# EAGLE design Arduino_Connection_PCB (EAGLE 9.5.1)
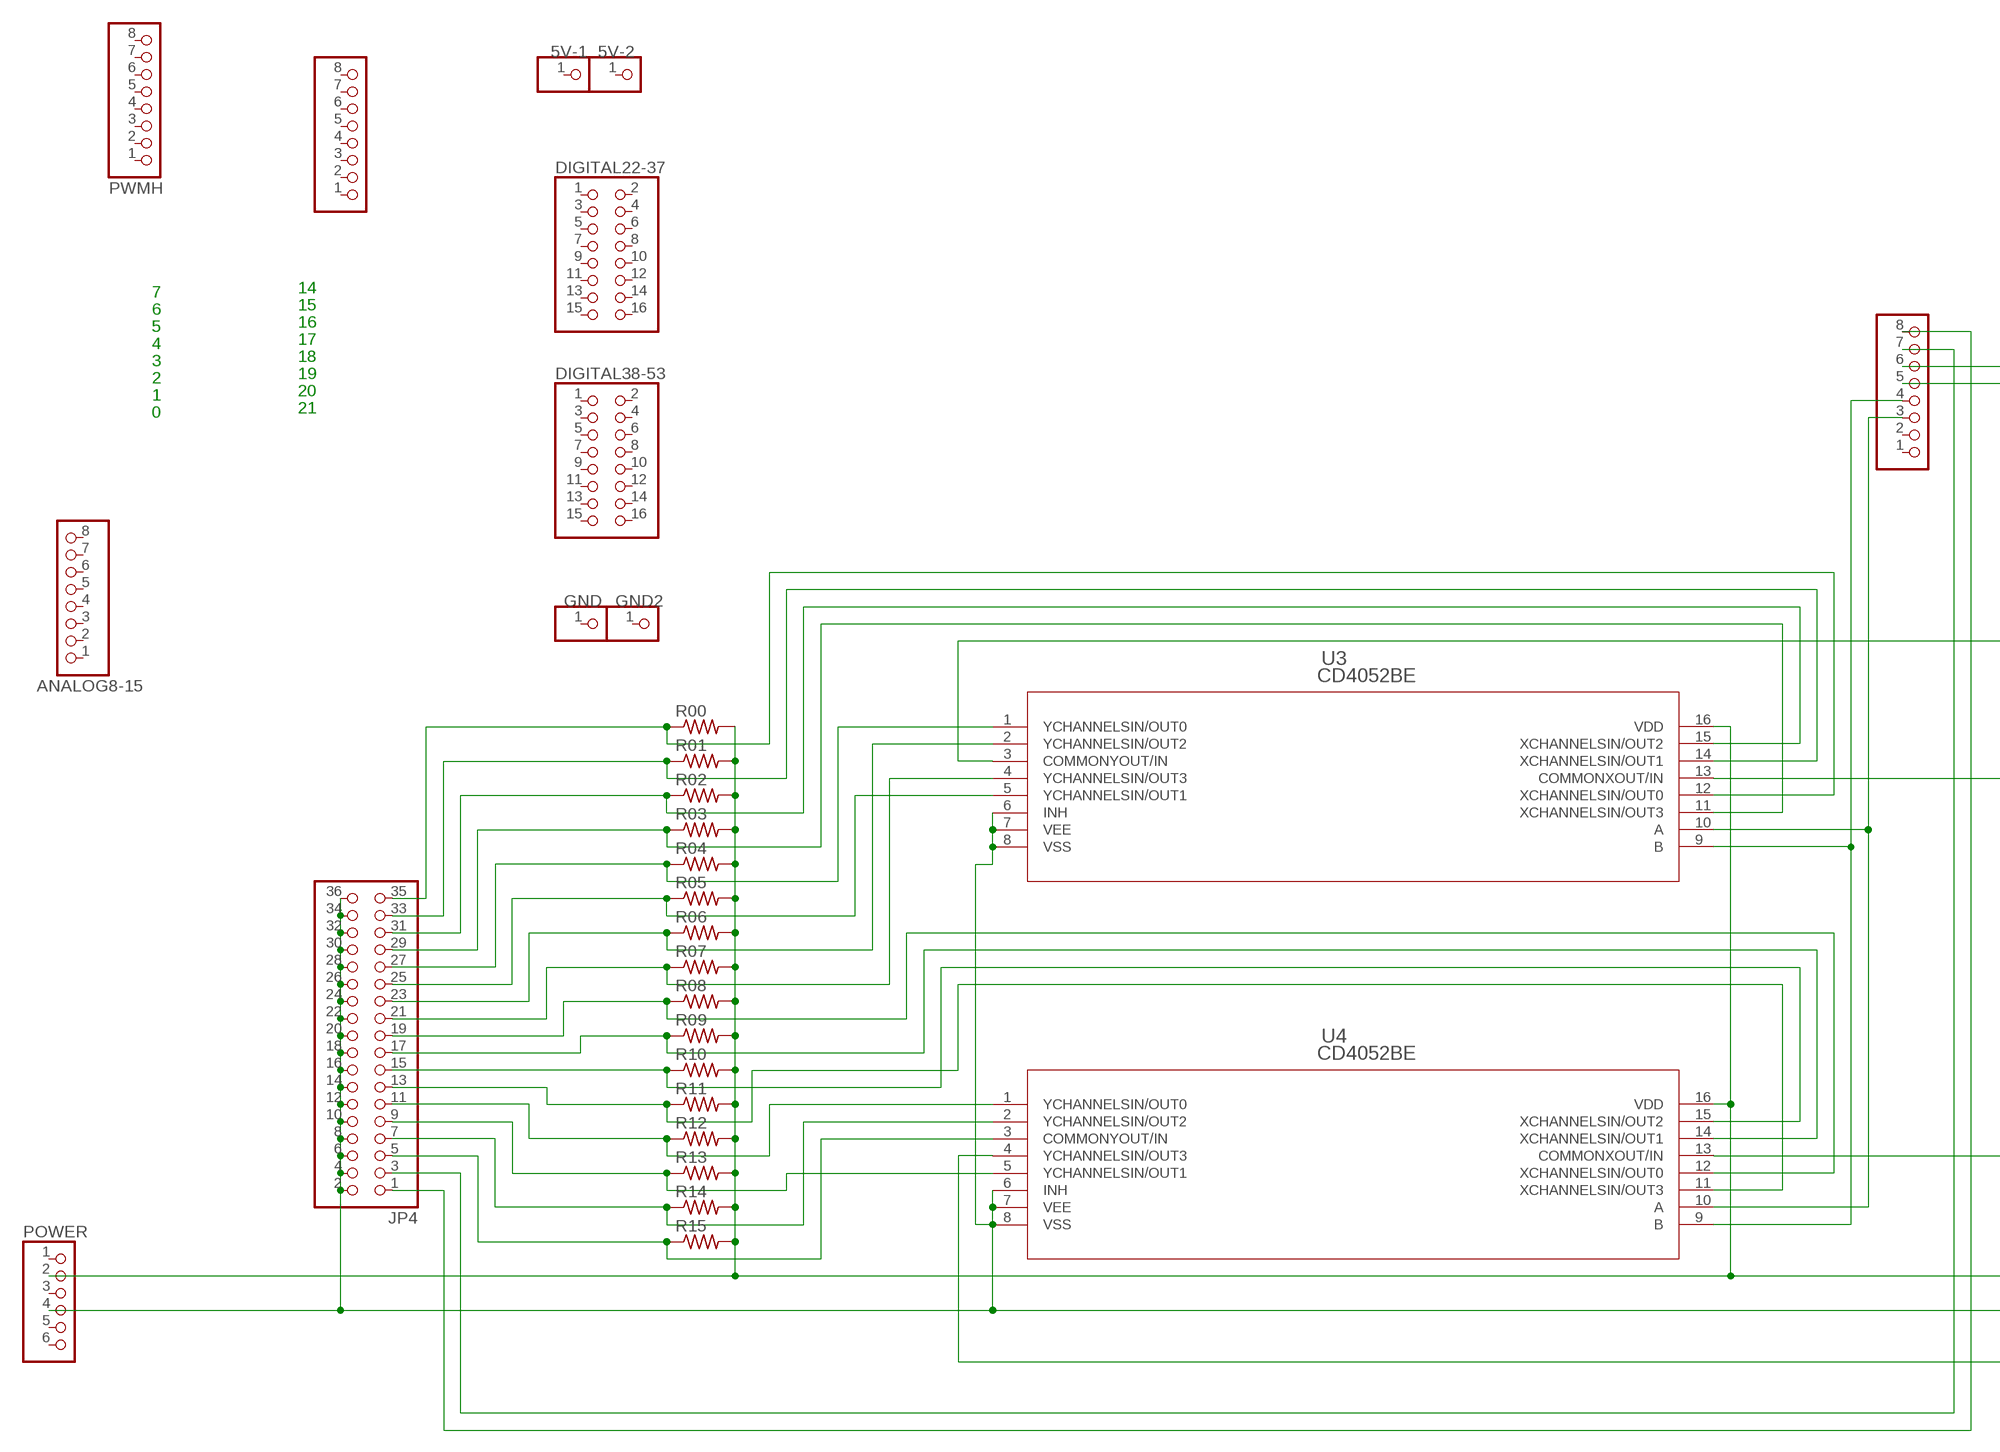
[diagram p0: schematic, sheet 1, part 1 of 2]
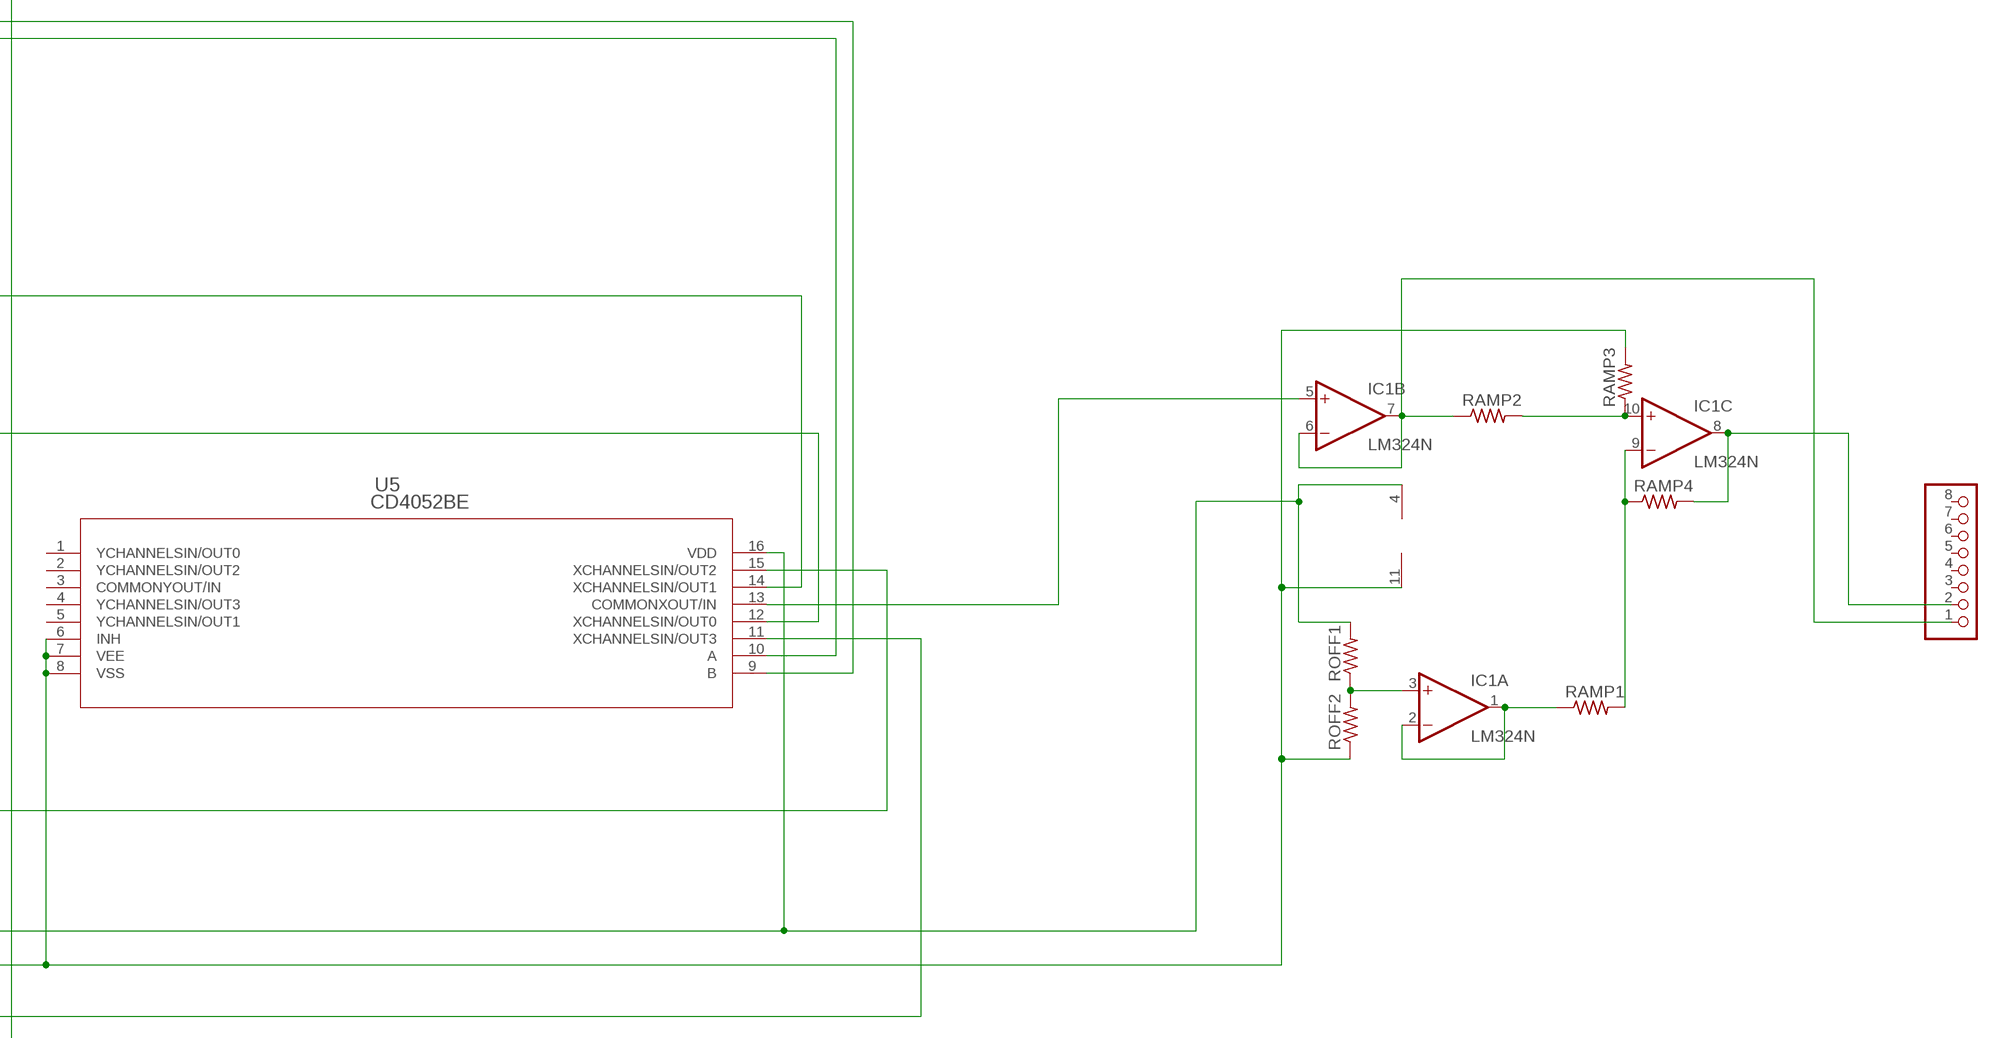
[diagram p1: schematic, sheet 1, part 2 of 2]

## Parts
5V-1  PINHD-1X1  [1X01]
5V-2  PINHD-1X1  [1X01]
ANALOG0-7  PINHD-1X8  [1X08]
ANALOG8-15  PINHD-1X8  [1X08]
COMMUNICATION  PINHD-1X8  [1X08]
DIGITAL22-37  PINHD-2X8  [2X08]
DIGITAL38-53  PINHD-2X8  [2X08]
GND  PINHD-1X1  [1X01]
GND2  PINHD-1X1  [1X01]
IC1  LM324N  [DIL14]
JP4  PINHD-2X18/90  [2X18/90]
POWER  PINHD-1X6  [1X06]
PWMH  PINHD-1X8  [1X08]
PWML  PINHD-1X8  [1X08]
R00  R-US_0204/7  [0204/7]
R01  R-US_0204/7  [0204/7]
R02  R-US_0204/7  [0204/7]
R03  R-US_0204/7  [0204/7]
R04  R-US_0204/7  [0204/7]
R05  R-US_0204/7  [0204/7]
R06  R-US_0204/7  [0204/7]
R07  R-US_0204/7  [0204/7]
R08  R-US_0204/7  [0204/7]
R09  R-US_0204/7  [0204/7]
R10  R-US_0204/7  [0204/7]
R11  R-US_0204/7  [0204/7]
R12  R-US_0204/7  [0204/7]
R13  R-US_0204/7  [0204/7]
R14  R-US_0204/7  [0204/7]
R15  R-US_0204/7  [0204/7]
RAMP1  R-US_0204/7  [0204/7]
RAMP2  R-US_0204/7  [0204/7]
RAMP3  R-US_0204/7  [0204/7]
RAMP4  R-US_0204/7  [0204/7]
ROFF1  R-US_0204/7  [0204/7]
ROFF2  R-US_0204/7  [0204/7]
U3  CD4052BE  [N16]
U4  CD4052BE  [N16]
U5  CD4052BE  [N16]

## Nets
N$1: IC1.5(B:+IN) U5.13(COMMONXOUT/IN)
N$2: ANALOG0-7.1 IC1.6(B:-IN) IC1.7(B:OUT) RAMP2.1
N$3: JP4.3 PWML.7
N$4: JP4.1 PWML.8
N$6: IC1.3(A:+IN) ROFF1.1 ROFF2.2
N$8: IC1.11(P:V-) JP4.2 JP4.4 JP4.6 JP4.8 JP4.10 JP4.12 JP4.14 JP4.16 JP4.18 JP4.20 JP4.22 JP4.24 JP4.26 JP4.28 JP4.30 JP4.32 JP4.34 JP4.36 POWER.4 RAMP3.2 ROFF2.1 U3.6(INH) U3.7(VEE) U3.8(VSS) U4.6(INH) U4.7(VEE) U4.8(VSS) U5.6(INH) U5.7(VEE) U5.8(VSS)
N$9: JP4.13 R11.1 U4.11(XCHANNELSIN/OUT3)
N$10: PWML.3 U3.10(A) U4.10(A)
N$11: IC1.4(P:V+) POWER.2 R00.2 R01.2 R02.2 R03.2 R04.2 R05.2 R06.2 R07.2 R08.2 R09.2 R10.2 R11.2 R12.2 R13.2 R14.2 R15.2 ROFF1.2 U3.16(VDD) U4.16(VDD) U5.16(VDD)
N$12: JP4.25 R05.1 U3.5(YCHANNELSIN/OUT1)
N$13: JP4.35 R00.1 U3.12(XCHANNELSIN/OUT0)
N$14: PWML.4 U3.9(B) U4.9(B)
N$15: JP4.19 R08.1 U4.12(XCHANNELSIN/OUT0)
N$16: JP4.21 R07.1 U3.4(YCHANNELSIN/OUT3)
N$17: JP4.17 R09.1 U4.14(XCHANNELSIN/OUT1)
N$18: JP4.5 R15.1 U4.3(COMMONYOUT/IN)
N$19: JP4.7 R14.1 U4.2(YCHANNELSIN/OUT2)
N$20: JP4.9 R13.1 U4.5(YCHANNELSIN/OUT1)
N$21: JP4.11 R12.1 U4.1(YCHANNELSIN/OUT0)
N$22: PWML.5 U5.10(A)
N$23: JP4.15 R10.1 U4.15(XCHANNELSIN/OUT2)
N$24: PWML.6 U5.9(B)
N$25: IC1.1(A:OUT) IC1.2(A:-IN) RAMP1.1
N$26: IC1.9(C:-IN) RAMP1.2 RAMP4.1
N$27: IC1.10(C:+IN) RAMP2.2 RAMP3.1
N$29: ANALOG0-7.2 IC1.8(C:OUT) RAMP4.2
N$30: U3.13(COMMONXOUT/IN) U5.12(XCHANNELSIN/OUT0)
N$31: U3.3(COMMONYOUT/IN) U5.14(XCHANNELSIN/OUT1)
N$32: U4.13(COMMONXOUT/IN) U5.15(XCHANNELSIN/OUT2)
N$33: U4.4(YCHANNELSIN/OUT3) U5.11(XCHANNELSIN/OUT3)
N$34: JP4.31 R02.1 U3.15(XCHANNELSIN/OUT2)
N$35: JP4.27 R04.1 U3.1(YCHANNELSIN/OUT0)
N$36: JP4.23 R06.1 U3.2(YCHANNELSIN/OUT2)
N$37: JP4.29 R03.1 U3.11(XCHANNELSIN/OUT3)
N$38: JP4.33 R01.1 U3.14(XCHANNELSIN/OUT1)
Unconnected: 5V-1.1 5V-2.1 ANALOG0-7.3 ANALOG0-7.4 ANALOG0-7.5 ANALOG0-7.6 ANALOG0-7.7 ANALOG0-7.8 ANALOG8-15.1 ANALOG8-15.2 ANALOG8-15.3 ANALOG8-15.4 ANALOG8-15.5 ANALOG8-15.6 ANALOG8-15.7 ANALOG8-15.8 COMMUNICATION.1 COMMUNICATION.2 COMMUNICATION.3 COMMUNICATION.4 COMMUNICATION.5 COMMUNICATION.6 COMMUNICATION.7 COMMUNICATION.8 DIGITAL22-37.1 DIGITAL22-37.2 DIGITAL22-37.3 DIGITAL22-37.4 DIGITAL22-37.5 DIGITAL22-37.6 DIGITAL22-37.7 DIGITAL22-37.8 DIGITAL22-37.9 DIGITAL22-37.10 DIGITAL22-37.11 DIGITAL22-37.12 DIGITAL22-37.13 DIGITAL22-37.14 DIGITAL22-37.15 DIGITAL22-37.16 DIGITAL38-53.1 DIGITAL38-53.2 DIGITAL38-53.3 DIGITAL38-53.4 DIGITAL38-53.5 DIGITAL38-53.6 DIGITAL38-53.7 DIGITAL38-53.8 DIGITAL38-53.9 DIGITAL38-53.10 DIGITAL38-53.11 DIGITAL38-53.12 DIGITAL38-53.13 DIGITAL38-53.14 DIGITAL38-53.15 DIGITAL38-53.16 GND2.1 GND.1 IC1.12(D:+IN) IC1.13(D:-IN) IC1.14(D:OUT) POWER.1 POWER.3 POWER.5 POWER.6 PWMH.1 PWMH.2 PWMH.3 PWMH.4 PWMH.5 PWMH.6 PWMH.7 PWMH.8 PWML.1 PWML.2 U5.1(YCHANNELSIN/OUT0) U5.2(YCHANNELSIN/OUT2) U5.3(COMMONYOUT/IN) U5.4(YCHANNELSIN/OUT3) U5.5(YCHANNELSIN/OUT1)

## Notes on the sheet
- 7 | 14
- 6 | 15
- 5 | 16
- 4 | 17
- 3 | 18
- 2 | 19
- 1 | 20
- 0 | 21

## Library data of the parts
5V-1 5V-2 GND GND2 = pinhead:PINHD-1X1: PIN HEADER
ANALOG0-7 ANALOG8-15 COMMUNICATION PWMH PWML = pinhead:PINHD-1X8: PIN HEADER
DIGITAL22-37 DIGITAL38-53 = pinhead:PINHD-2X8: PIN HEADER
IC1 = linear:LM324: OP AMP
JP4 = pinhead:PINHD-2X18: PIN HEADER
POWER = pinhead:PINHD-1X6: PIN HEADER
R00 R01-R09 R10-R15 RAMP1-RAMP4 ROFF1 ROFF2 = rcl:R-US_: RESISTOR, American symbol; SPICEPREFIX: R
U3-U5 = cd4052:CD4052BE; BUILT_BY: EMA_UL_Team; MANUFACTURER_PART_NUMBER: CD4052BE; VENDOR: Texas Instruments

## Net classes
0 default: width 0.15 mm, drill 0.3 mm, clearance 0.15 mm

## Board
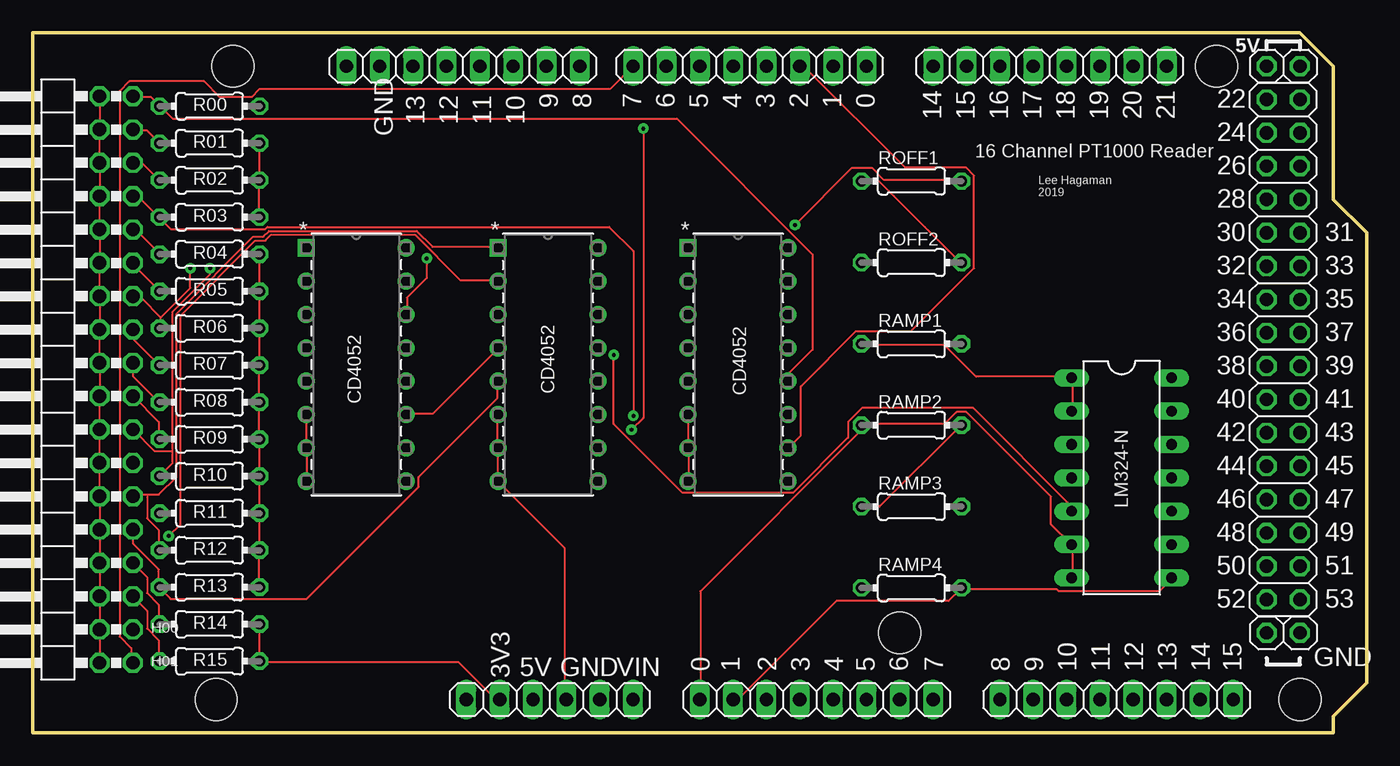
[diagram p2: board, top side]
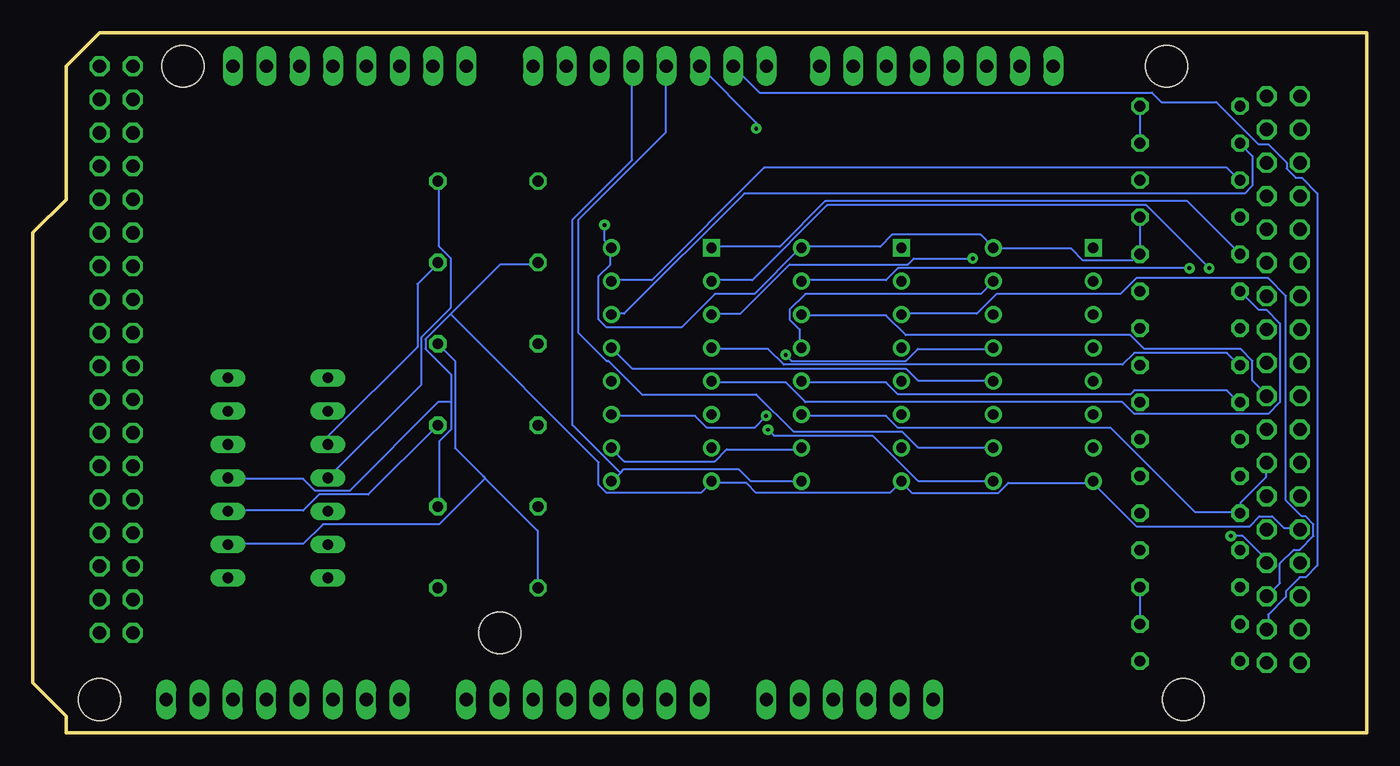
[diagram p3: board, bottom side, seen from below]

Size 101.6 x 53.34 mm. Coordinates in mm from the lower left corner, seen from the top.
Outline: 0,53.34 96.52,53.34 99.06,50.8 99.06,40.64 101.6,38.1 101.6,3.81 99.06,1.27 99.06,0 0,0 0,53.34
Copper layers (1*16): Top 0.035mm / dielectric 1.5mm / Bottom 0.035mm
Design rules "default *": minimum track width 0.15mm, minimum drill 0.3mm, track to track 0.15mm, track to pad 0.15mm, pad to pad 0.15mm, via to via 0.15mm, smd to smd 0.15mm, copper to edge 0.6mm, drill to drill 0.3mm, minimum pad ring 10mil, minimum via ring 10mil, stop-mask expansion 2mil, vias tented up to drill 1mil, thermal gap 10mil
Holes 3.2 mm at 96.52,2.54 15.24,50.8 90.17,50.8 13.97,2.54 66.04,7.62
tRestrict: area 22,18.2 to 27.6,37.5; area 36.4,18.9 to 42.3,37.8; area 50.8,18.8 to 56.8,38.1; area 80.6,11.2 to 85,28.2
vRestrict: area 22,18 to 27.7,37.6; area 35.9,18.4 to 42.4,37.7; area 50.8,18.8 to 56.9,37.7; area 80.6,11.2 to 85.1,28.1

### Footprints (pad centres in the part's own frame; a part is rotated, then mirrored left to right if it is on the bottom)
1X01 = drill 1.016 octagon: 1 0,0
1X08 = drill 1.016 long: 1 -8.89,0; 2 -6.35,0; 3 -3.81,0; 4 -1.27,0; 5 1.27,0; 6 3.81,0; 7 6.35,0; 8 8.89,0
2X08 = drill 1.016 octagon: 1 -8.89,-1.27; 2 -8.89,1.27; 3 -6.35,-1.27; 4 -6.35,1.27; 5 -3.81,-1.27; 6 -3.81,1.27; 7 -1.27,-1.27; 8 -1.27,1.27; 9 1.27,-1.27; 10 1.27,1.27; 11 3.81,-1.27; 12 3.81,1.27; 13 6.35,-1.27; 14 6.35,1.27; 15 8.89,-1.27; 16 8.89,1.27
DIL14 = drill 0.813 long: 1 -7.62,-3.81; 2 -5.08,-3.81; 3 -2.54,-3.81; 4 0,-3.81; 5 2.54,-3.81; 6 5.08,-3.81; 7 7.62,-3.81; 8 7.62,3.81; 9 5.08,3.81; 10 2.54,3.81; 11 0,3.81; 12 -2.54,3.81; 13 -5.08,3.81; 14 -7.62,3.81
2X18/90 = drill 1.016 octagon: 1 -21.59,-6.35; 2 -21.59,-3.81; 3 -19.05,-6.35; 4 -19.05,-3.81; 5 -16.51,-6.35; 6 -16.51,-3.81; 7 -13.97,-6.35; 8 -13.97,-3.81; 9 -11.43,-6.35; 10 -11.43,-3.81; 11 -8.89,-6.35; 12 -8.89,-3.81; 13 -6.35,-6.35; 14 -6.35,-3.81; 15 -3.81,-6.35; 16 -3.81,-3.81; 17 -1.27,-6.35; 18 -1.27,-3.81; 19 1.27,-6.35; 20 1.27,-3.81; 21 3.81,-6.35; 22 3.81,-3.81; 23 6.35,-6.35; 24 6.35,-3.81; 25 8.89,-6.35; 26 8.89,-3.81; 27 11.43,-6.35; 28 11.43,-3.81; 29 13.97,-6.35; 30 13.97,-3.81; 31 16.51,-6.35; 32 16.51,-3.81; 33 19.05,-6.35; 34 19.05,-3.81; 35 21.59,-6.35; 36 21.59,-3.81
1X06 = drill 1.016 long: 1 -6.35,0; 2 -3.81,0; 3 -1.27,0; 4 1.27,0; 5 3.81,0; 6 6.35,0
0204/7 = drill 0.813 octagon: 1 -3.81,0; 2 3.81,0
N16 = drill 0.787 pad 1.295 square: 1 -7.62,17.78 | drill 0.787 pad 1.295: 2 -7.62,15.24; 3 -7.62,12.7; 4 -7.62,10.16; 5 -7.62,7.62; 6 -7.62,5.08; 7 -7.62,2.54; 8 -7.62,0; 9 0,0; 10 0,2.54; 11 0,5.08; 12 0,7.62; 13 0,10.16; 14 0,12.7; 15 0,15.24; 16 0,17.78

### Placement (x,y rotation side)
5V-1  93.98,50.8 0 top
5V-2  96.52,50.8 0 top
ANALOG0-7  59.69,2.54 0 top
ANALOG8-15  82.55,2.54 0 top
COMMUNICATION  77.47,50.8 180 top
DIGITAL22-37  95.25,39.37 90 top
DIGITAL38-53  95.25,19.05 90 top
GND  93.98,7.62 0 top
GND2  96.52,7.62 0 top
IC1  82.93,19.43 270 top
JP4  1.27,26.92 90 top
POWER  39.37,2.54 0 top
PWMH  32.77,50.8 180 top
PWML  54.61,50.8 180 top
R00  13.46,47.75 0 top
R01  13.46,44.93 0 top
R02  13.46,42.11 0 top
R03  13.46,39.29 0 top
R04  13.46,36.47 0 top
R05  13.46,33.65 0 top
R06  13.46,30.84 0 top
R07  13.46,28.02 0 top
R08  13.46,25.2 0 top
R09  13.46,22.38 0 top
R10  13.46,19.56 0 top
R11  13.46,16.74 0 top
R12  13.46,13.92 0 top
R13  13.46,11.1 0 top
R14  13.46,8.28 0 top
R15  13.46,5.46 0 top
RAMP1  66.93,29.64 0 top
RAMP2  66.93,23.44 0 top
RAMP3  66.93,17.25 0 top
RAMP4  66.93,11.05 0 top
ROFF1  66.93,42.04 0 top
ROFF2  66.93,35.84 0 top
U3  57.53,19.18 0 top
U4  43.05,19.18 0 top
U5  28.45,19.18 0 top

### Tracks (layer width: path | path; a pad name or v marks a point on that pad's centre or on a via)
N$1  (via drill 0.3)
  Top 0.15: v44.25,28.8 44.25,23.55 49.5,18.3 57.9,18.3 62.1,22.5 62.1,23.7 63.15,24.75 71.63,24.75 79.12,17.26 IC1.5
  Bottom 0.15: v44.25,28.8 43.8,28.35 35.1,28.35 34.2,29.25 28.5,29.25 U5.13
N$2
  Top 0.15: IC1.7 79.2,11.85 79.2,14.25 IC1.6 79.05,14.4 77.55,15.9 77.55,18 71.1,24.45 70.35,24.45 69.45,23.55 63.15,23.55 RAMP2.1 63,23.4 63,22.95 50.85,10.8 50.85,2.55 ANALOG0-7.1
N$3
  Bottom 0.15: JP4.3 7.5,7.95 7.5,9 6.15,10.35 6.15,10.8 5.1,11.85 4.65,11.85 3.75,12.75 3.75,41.1 4.95,42.3 5.4,42.3 6.09,42.99 6.09,43.44 7.5,44.85 8.25,44.85 11.47,48.07 15.63,48.07 16.36,48.8 46.25,48.8 48.15,50.7 PWML.7
N$4
  Top 0.15: JP4.1 7.5,5.4 7.5,6.45 6.6,7.35 6.6,48.9 7.35,49.65 13.05,49.65 14.25,48.45 16.65,48.45 17.25,49.05 43.95,49.05 45.6,50.7 PWML.8
N$6
  Top 0.15: ROFF1.1 63.15,42 64.5,42 70.65,35.85 ROFF2.2
  Bottom 0.15: IC1.3 79.05,22.05 79.05,22.65 72.3,29.4 72.3,34.2 70.8,35.7 ROFF2.2
N$8
  Top 0.15: JP4.2 5.1,5.4 5.1,7.8 JP4.4 5.1,7.95 5.1,10.35 JP4.6 5.1,10.5 5.1,12.9 JP4.8 5.1,13.05 5.1,15.45 JP4.10 5.1,15.6 5.1,18 JP4.12 5.1,18.15 5.1,20.55 JP4.14 5.1,20.7 5.1,23.1 JP4.16 5.1,23.25 5.1,25.65 JP4.18 5.1,25.8 5.1,28.05 JP4.20 5.1,28.2 5.1,30.6 JP4.22 5.1,30.75 5.1,33.15 JP4.24 5.1,33.3 5.1,35.7 JP4.26 5.1,35.85 5.1,38.25 JP4.28 5.1,38.4 5.1,40.8 JP4.30 5.1,40.95 5.1,43.35 JP4.32 5.1,43.5 5.1,45.9 JP4.34 5.1,46.05 5.1,48.45 JP4.36 | U3.8 49.95,19.2 49.95,21.6 U3.7 49.95,21.75 49.95,24.15 U3.6 | U5.8 20.85,19.2 20.85,21.6 U5.7 20.85,21.75 20.85,24.15 U5.6 | U4.6 35.4,24.15 35.4,21.75 U4.7 35.4,21.6 35.4,19.2 U4.8 35.55,19.05 40.5,14.1 40.5,2.55 POWER.4
  Bottom 0.15: 69.75,25.21 69.75,27.3 71.7,29.25 71.7,30 69.8,31.9 | 69.75,25.21 69.75,23.1 70.65,22.2 70.65,17.25 RAMP3.2 | 69.8,31.9 66,35.7 63.15,35.7 ROFF2.1 | 69.75,25.21 70.72,25.21 77.48,18.45 80.1,18.45 81,19.35 86.7,19.35 IC1.11 | 20.85,19.05 27.3,19.05 28.05,18.3 34.65,18.3 35.4,19.05 U4.8 35.55,19.05 36.3,18.3 46.5,18.3 47.25,19.05 49.8,19.05 U3.8 49.95,19.05 50.7,18.3 57.9,18.3 58.5,18.9 58.5,20.61 69.8,31.9 | 20.85,19.05 17.55,15.75 8.92,15.75 8.17,16.5 7.2,16.5 6.3,15.6 5.1,15.6 JP4.10 | 20.85,19.05 U5.8
N$9
  Bottom 0.15: U4.11 43.05,24.15 36.6,24.15 35.7,23.25 19.5,23.25 13.05,16.8 9.75,16.8 R11.1 9.6,16.8 9.6,17.55 7.65,19.5 7.65,20.55 JP4.13
N$10
  Top 0.15: PWML.3 58.5,50.7 58.8,50.7 66.45,43.05 71.1,43.05 71.7,42.45 71.7,35.4 66.9,30.6 62.7,30.6 58.5,26.4 58.5,22.65 57.6,21.75 U3.10
  Bottom 0.15: U4.10 43.2,21.6 48.75,21.6 49.65,20.7 56.55,20.7 57.45,21.6 U3.10
N$11  (via drill 0.3)
  Top 0.15: R14.2 17.25,8.25 17.25,5.55 R15.2 17.4,5.4 32.4,5.4 35.25,2.55 POWER.2 | R13.2 17.25,11.1 17.25,13.8 R12.2 17.25,13.95 17.25,16.65 R11.2 17.25,16.8 17.25,19.5 R10.2 17.25,19.65 17.25,22.35 R09.2 17.25,22.5 17.25,25.05 R08.2 17.25,25.2 17.25,27.9 R07.2 17.25,28.05 17.25,30.75 R06.2 17.25,30.9 17.25,33.6 R05.2 17.25,33.75 17.25,36.45 R04.2 | R01.2 17.25,44.85 17.25,42.15 R02.2 17.25,42 17.25,39.3 R03.2 | v58.05,38.7 62.4,43.05 63.9,43.05 64.8,42.15 70.65,42.15 ROFF1.2
  Bottom 0.15: R13.2 17.25,10.95 17.25,8.4 R14.2 | ROFF1.2 70.65,42 70.65,37.05 69.75,36.15 69.75,32.4 72,30.15 72,26.55 79.05,19.5 IC1.4 | R00.2 17.25,47.7 17.25,45 R01.2 | R03.2 17.25,39.15 17.25,36.6 R04.2 17.4,36.45 17.85,36 21.6,36 22.5,36.9 28.35,36.9 U5.16 28.5,37.05 29.4,37.95 36.15,37.95 37.05,37.05 43.05,37.05 U4.16 43.2,36.9 46.65,33.45 49.65,33.45 52.2,30.9 57.9,30.9 58.5,31.5 58.5,34.8 57.6,35.7 57.6,36.9 U3.16 57.6,37.05 58.05,37.5 v58.05,38.7
N$12
  Top 0.15: JP4.25 7.65,35.7 9.6,33.75 R05.1
  Bottom 0.15: U3.5 49.8,26.7 44.25,26.7 42.75,25.2 18.6,25.2 17.7,24.3 7.5,24.3 6.6,25.2 6.6,31.2 7.65,32.25 8.25,32.25 9.6,33.6 R05.1
N$13
  Top 0.15: U3.12 57.6,26.85 57.6,27.41 59.39,29.2 59.39,36.46 49.05,46.8 10.65,46.8 9.75,47.7 R00.1 9.6,47.85 9,48.45 7.65,48.45 JP4.35
N$14
  Bottom 0.15: 56.85,19.8 57.45,19.2 U3.9 | 56.85,19.8 56.55,20.1 47.85,20.1 46.95,19.2 43.2,19.2 U4.9 | 56.85,19.8 60.5,23.45 60.5,39.1 55.95,43.65 55.95,50.7 PWML.4
N$15
  Top 0.15: JP4.19 7.65,28.05 7.65,27.15 9.6,25.2 R08.1
  Bottom 0.15: U4.12 43.05,26.7 36.6,26.7 35.7,25.8 18,25.8 17.7,26.1 10.65,26.1 9.75,25.2 R08.1
N$16
  Top 0.15: JP4.21 7.65,30.6 7.65,30 9.6,28.05 R07.1
  Bottom 0.15: U3.4 49.8,29.25 45.6,29.25 44.4,28.05 18.6,28.05 17.7,28.95 10.65,28.95 9.75,28.05 R07.1
N$17
  Top 0.15: R09.1 9.6,22.5 9.6,23.7 7.65,25.65 JP4.17
  Bottom 0.15: U4.14 43.05,31.8 36.6,31.8 35.1,30.3 18,30.3 16.95,29.25 9.6,29.25 8.7,28.35 8.7,26.85 7.65,25.8 JP4.17
N$18
  Top 0.15: R15.1 9.6,5.55 9.6,7.05 8.7,7.95 8.7,9.3 7.65,10.35 JP4.5
  Bottom 0.15: U4.3 35.4,31.95 29.7,31.95 28.2,33.45 18.75,33.45 17.55,34.65 7.5,34.65 6.15,33.3 6.15,17.7 4.95,16.5 4.65,16.5 4.05,15.9 4.05,15 5.1,13.95 5.55,13.95 6.6,12.9 6.6,11.4 7.5,10.5 JP4.5
N$19  (via drill 0.3)
  Top 0.15: v10.35,15 11.25,15.9 11.25,31.8 16.95,37.5 17.7,37.5 18.15,37.95 29.1,37.95 32.55,34.5 35.4,34.5 U4.2 | R14.1 9.6,8.4 9.6,9.75 8.7,10.65 8.7,11.85 7.65,12.9 JP4.7
  Bottom 0.15: v10.35,15 9.45,15 7.5,13.05 JP4.7
N$20
  Top 0.15: U4.5 35.4,26.7 35.4,25.5 29.4,19.5 29.4,18.75 20.85,10.2 10.5,10.2 9.75,10.95 R13.1 9.6,11.1 9.6,12.45 7.65,14.4 7.65,15.45 JP4.9
N$21
  Top 0.15: 8.7,18.15 7.65,18.15 JP4.11 | 8.7,18.15 9.6,18.15 10.95,19.5 10.95,31.95 16.8,37.8 17.55,37.8 18,38.25 29.25,38.25 30.45,37.05 35.4,37.05 U4.1 | 8.7,18.15 8.7,16.35 9.6,15.45 9.6,13.95 R12.1
N$22
  Bottom 0.15: U5.10 28.5,21.75 34.2,21.75 35.4,22.95 43.65,22.95 46.5,25.8 55.2,25.8 57.75,28.35 57.9,28.35 60.07,30.52 60.07,39.08 53.4,45.75 53.4,50.7 PWML.5
N$23  (via drill 0.3)
  Top 0.15: v13.5,35.4 13.5,34.95 10.65,32.1 10.65,21.45 | 10.65,21.45 10.65,20.55 9.75,19.65 R10.1 | 10.65,21.45 9.3,21.45 7.65,23.1 JP4.15
  Bottom 0.15: v13.5,35.4 35.7,35.4 36.6,34.5 43.05,34.5 U4.15
N$24  (via drill 0.3)
  Top 0.15: v45.6,23.1 46.5,24 v46.5,46.05
  Bottom 0.15: v45.6,23.1 45.15,22.65 37.65,22.65 34.2,19.2 28.5,19.2 U5.9 | v46.5,46.05 46.5,46.5 PWML.6
N$25
  Top 0.15: IC1.2 79.2,24.6 79.2,27 IC1.1 79.05,27.15 71.85,27.15 69.45,29.55 63.15,29.55 RAMP1.1
N$26
  Bottom 0.15: 67.15,19.4 67.28,19.52 69.45,21.69 69.45,28.35 70.65,29.55 RAMP1.2 | 67.15,19.4 63.15,15.39 63.15,11.1 RAMP4.1 | 67.15,19.4 70.65,15.9 79.5,15.9 81,14.4 86.7,14.4 IC1.9
N$27
  Top 0.15: RAMP3.1 63.15,17.25 64.5,17.25 70.65,23.4 RAMP2.2
  Bottom 0.15: IC1.10 86.7,16.95 81,16.95 79.8,18.15 76.05,18.15 70.8,23.4 RAMP2.2
N$29
  Top 0.15: IC1.8 86.7,11.7 85.8,10.8 78.15,10.8 78,10.95 70.8,10.95 RAMP4.2 70.65,10.95 69.75,10.05 61.2,10.05 53.7,2.55 53.4,2.55 ANALOG0-7.2
N$30
  Bottom 0.15: U5.12 28.5,26.85 34.2,26.85 35.1,27.75 55.95,27.75 57.45,29.25 U3.13
N$31  (via drill 0.3)
  Top 0.15: v30,36.15 30,34.65 28.5,33.15 28.5,31.95 U5.14
  Bottom 0.15: v30,36.15 34.5,36.15 34.95,35.7 43.95,35.7 47.7,31.95 49.8,31.95 U3.3
N$32
  Bottom 0.15: U4.13 43.2,29.4 43.2,30.75 43.95,31.5 43.95,32.25 42.75,33.45 29.4,33.45 28.5,34.35 U5.15
N$33
  Top 0.15: U5.11 28.5,24.3 30.45,24.3 35.4,29.25 U4.4
N$34
  Top 0.15: JP4.31 7.65,43.35 8.4,43.35 9.6,42.15 R02.1
  Bottom 0.15: U3.15 57.45,34.5 54.45,34.5 45.9,43.05 10.65,43.05 9.75,42.15 R02.1
N$35
  Top 0.15: JP4.27 7.65,38.25 7.95,38.25 9.6,36.6 R04.1
  Bottom 0.15: U3.1 49.8,37.05 44.7,37.05 41.25,40.5 13.65,40.5 9.75,36.6 R04.1
N$36  (via drill 0.3)
  Top 0.15: v12,35.4 12,33.9 9.75,31.65 | 9.75,31.65 9.75,30.9 R06.1 | 9.75,31.65 8.25,33.15 7.65,33.15 JP4.23
  Bottom 0.15: v12,35.4 16.8,40.2 41.1,40.2 46.8,34.5 49.8,34.5 U3.2
N$37  (via drill 0.3)
  Top 0.15: v45.75,24.15 45.75,36.69 43.89,38.55 17.85,38.55 17.7,38.4 10.5,38.4 9.75,39.15 R03.1 9.6,39.3 8.1,40.8 7.65,40.8 JP4.29
  Bottom 0.15: v45.75,24.15 46.65,23.25 50.25,23.25 51.15,24.15 57.45,24.15 U3.11
N$38
  Top 0.15: JP4.33 7.65,45.9 8.7,45.9 9.6,45 R01.1
  Bottom 0.15: U3.14 57.45,31.95 56.55,31.95 47.4,41.1 9.3,41.1 8.7,41.7 8.7,43.95 9.6,44.85 R01.1

### Text on the board
tPlace: 9 | 8 | 7 | 6 | 5 | 4 | 3 | 2 | 1 | 0 | 22 | 14 | 15 | 16 | 17 | 18 | 19 | 20 | 21 | 13 | 12 | 11 | 10 | 24 | 26 | 28 | 30 | 31 | 32 | 33 | 34 | 35 | 36 | 37 | 38 | 39 | 40 | 41 | 42 | 43 | 44 | 45 | 46 | 47 | 48 | 49 | 50 | 51 | 52 | 53 | 0 | 1 | 2 | 3 | 4 | 5 | 6 | 7 | 8 | 9 | 10 | 11 | 12 | 13 | 14 | 15
tNames: 5V | GND | 16 Channel PT1000 Reader | Lee Hagaman / 2019 | CD4052 | CD4052 | CD4052 | LM324-N | H00 | H01 | GND | 3V3 | 5V | GND | VIN
ReferenceLC: L | TX | RX | PC1 | PC2